# Altium schematic sheet IoTC.SchDoc
size A1
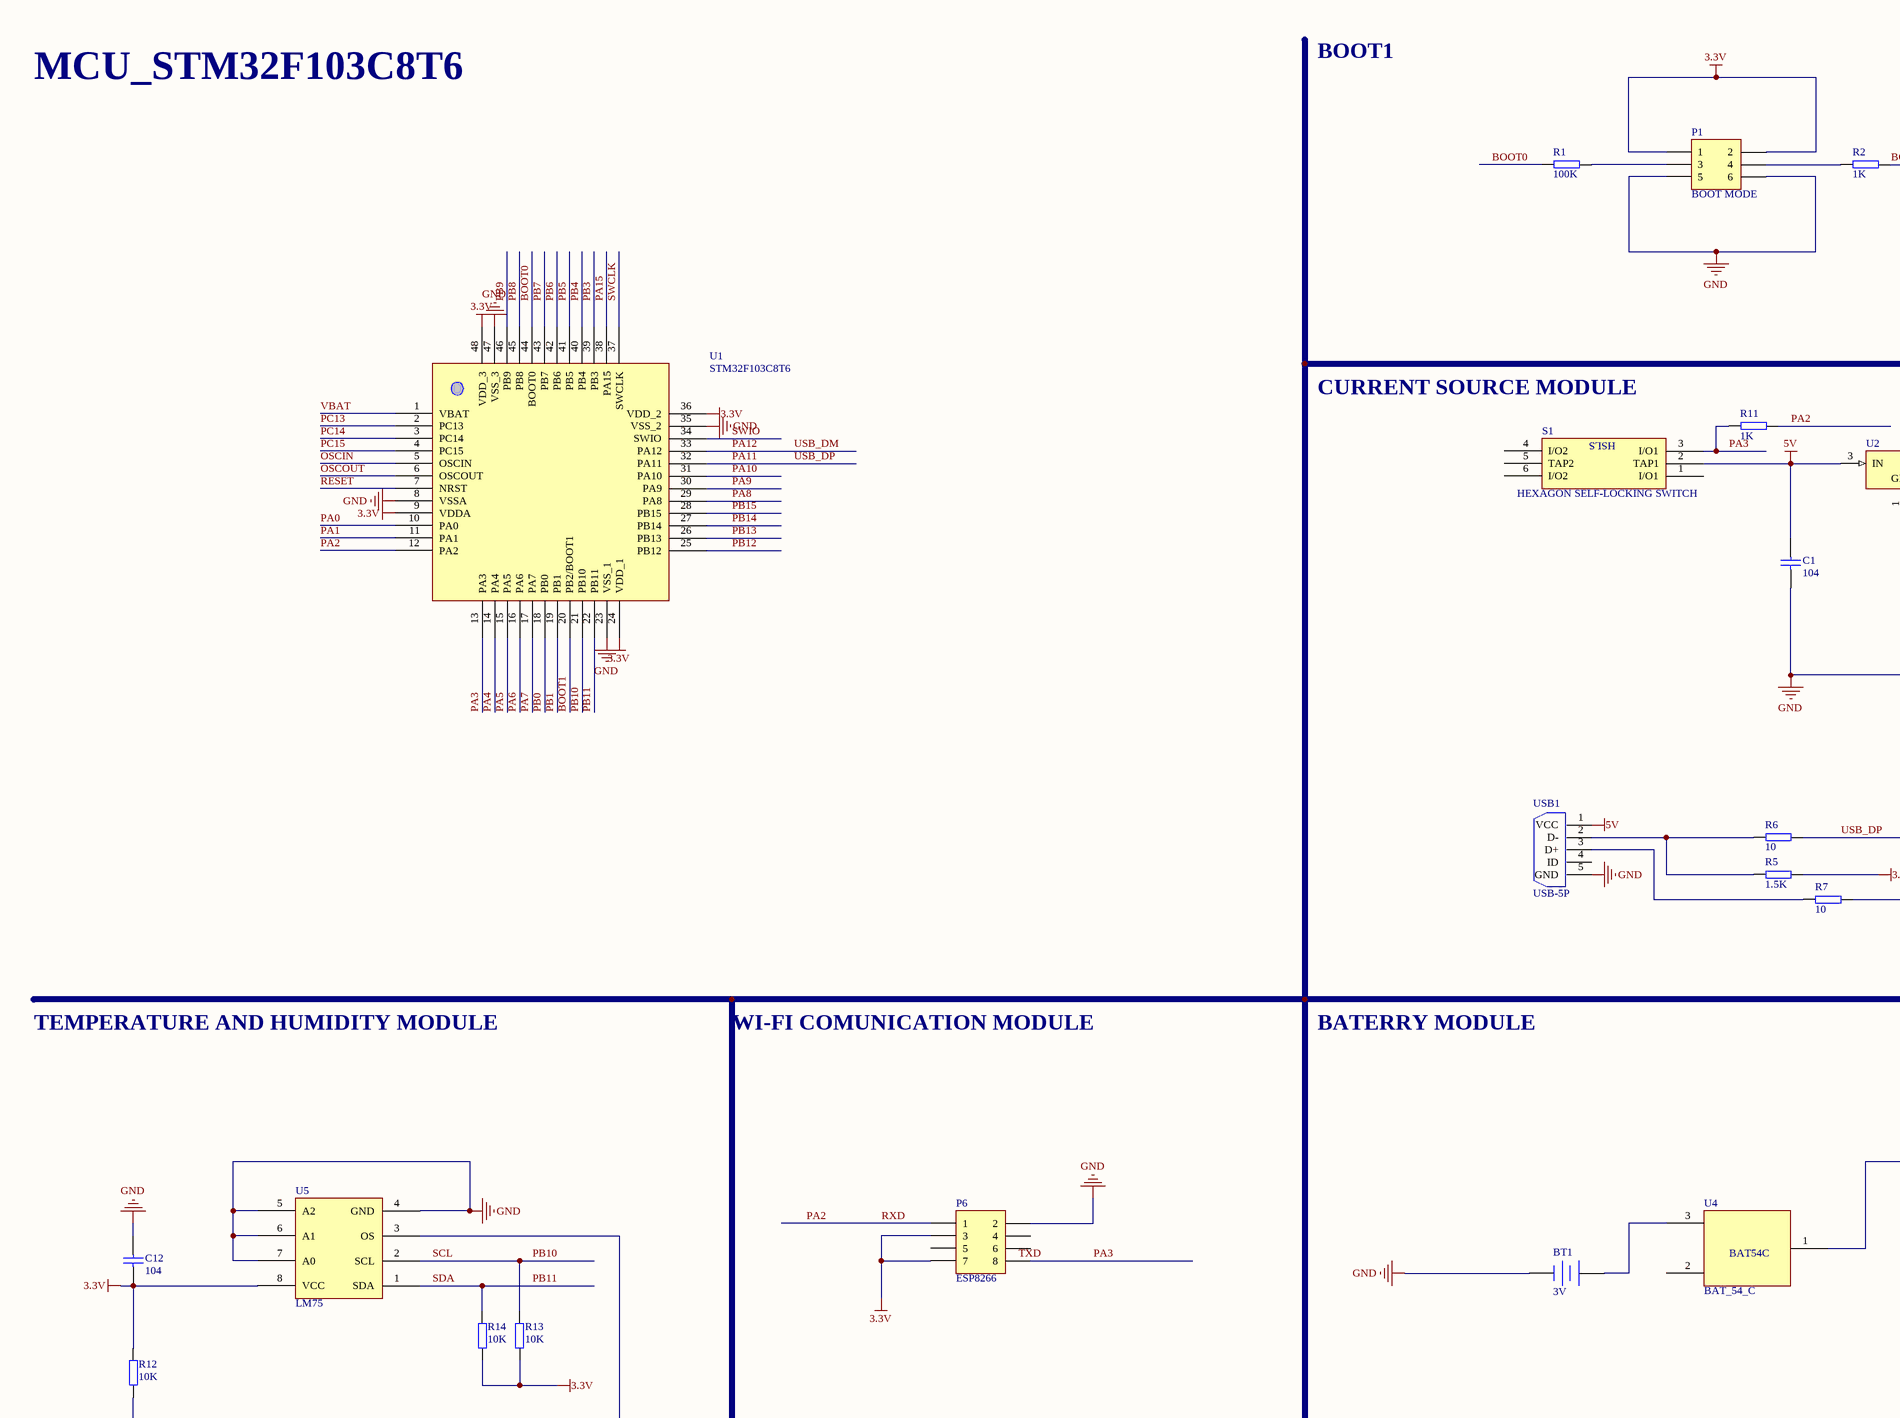
[diagram p0: IoTC.SchDoc, top left]
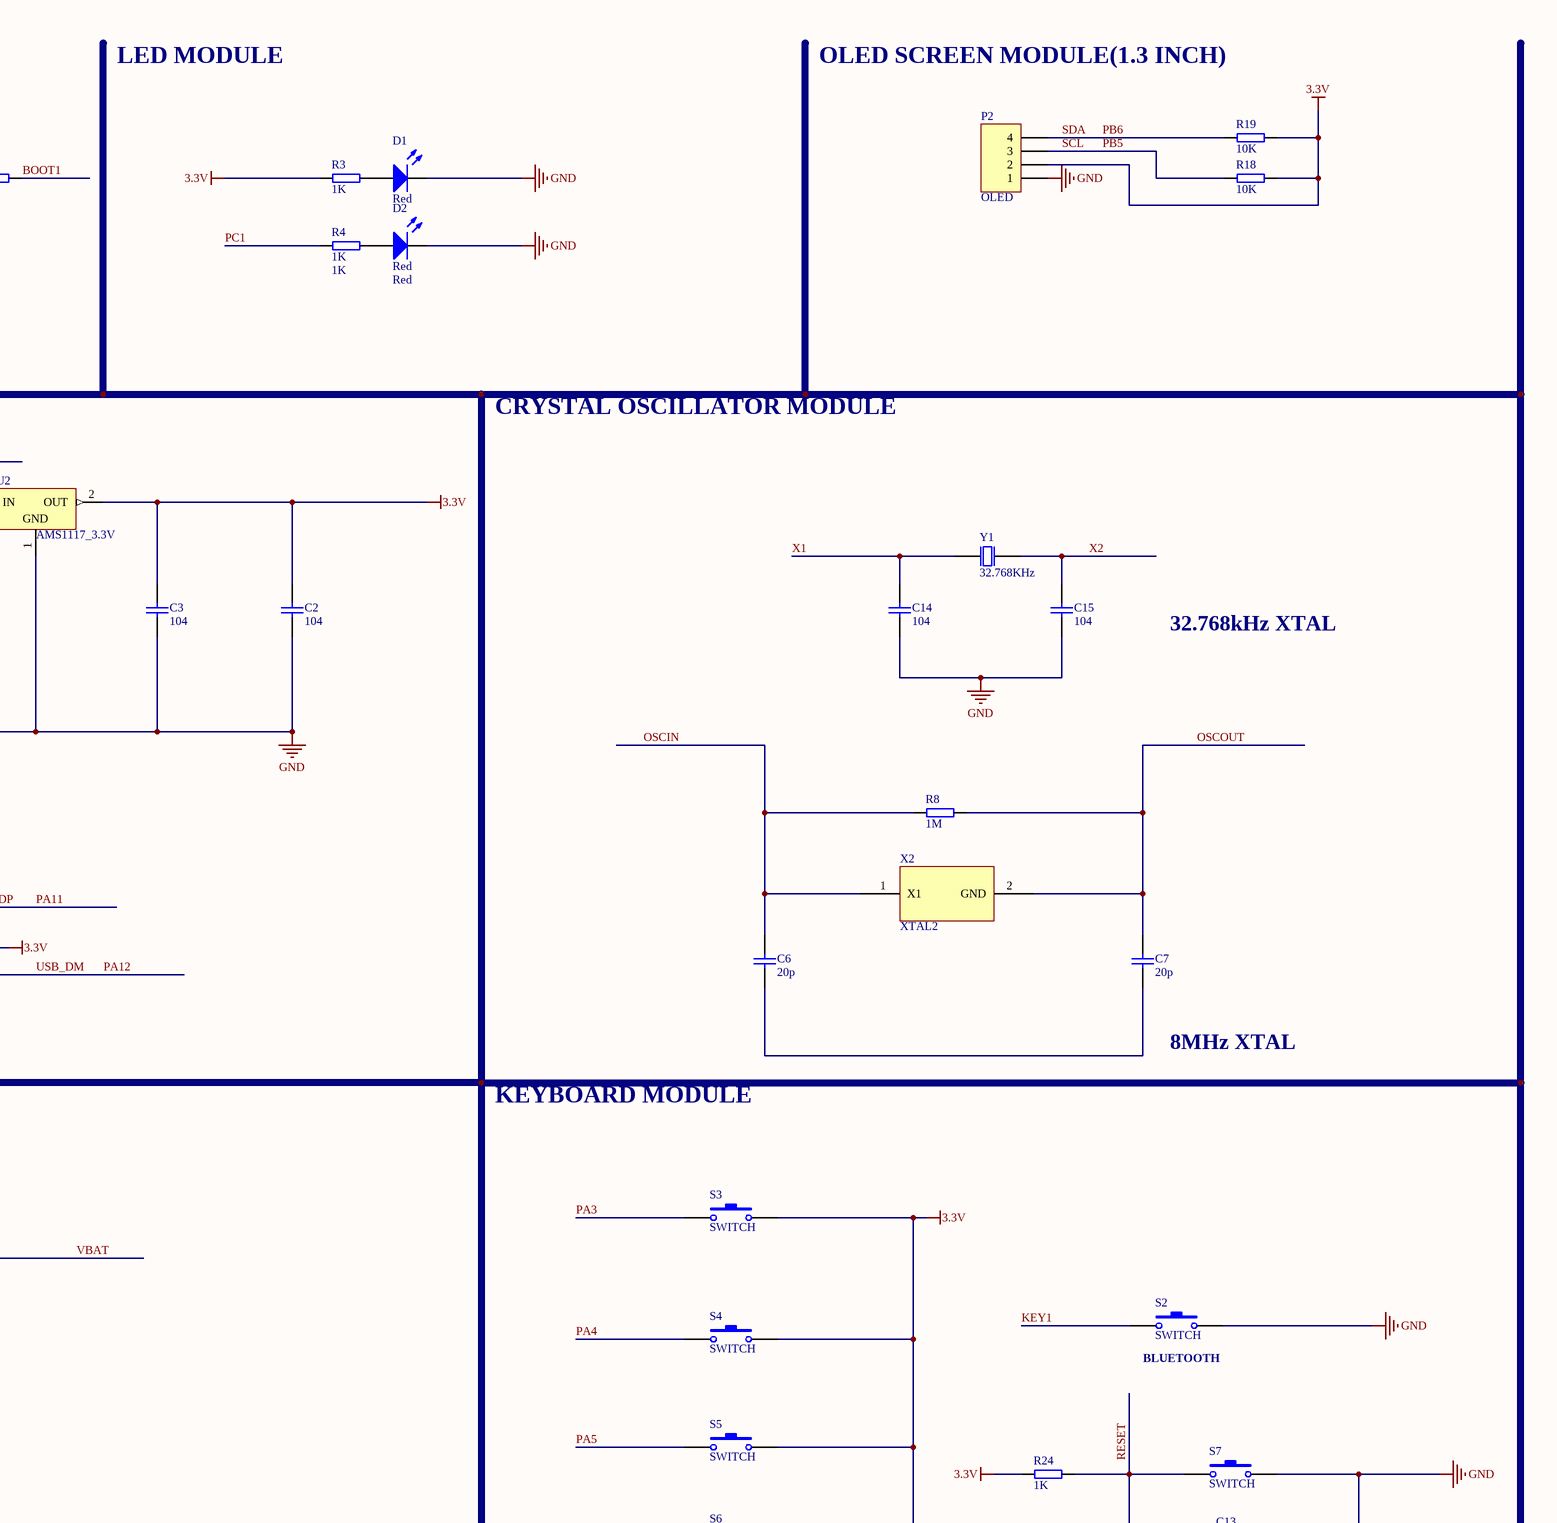
[diagram p1: IoTC.SchDoc, top right]
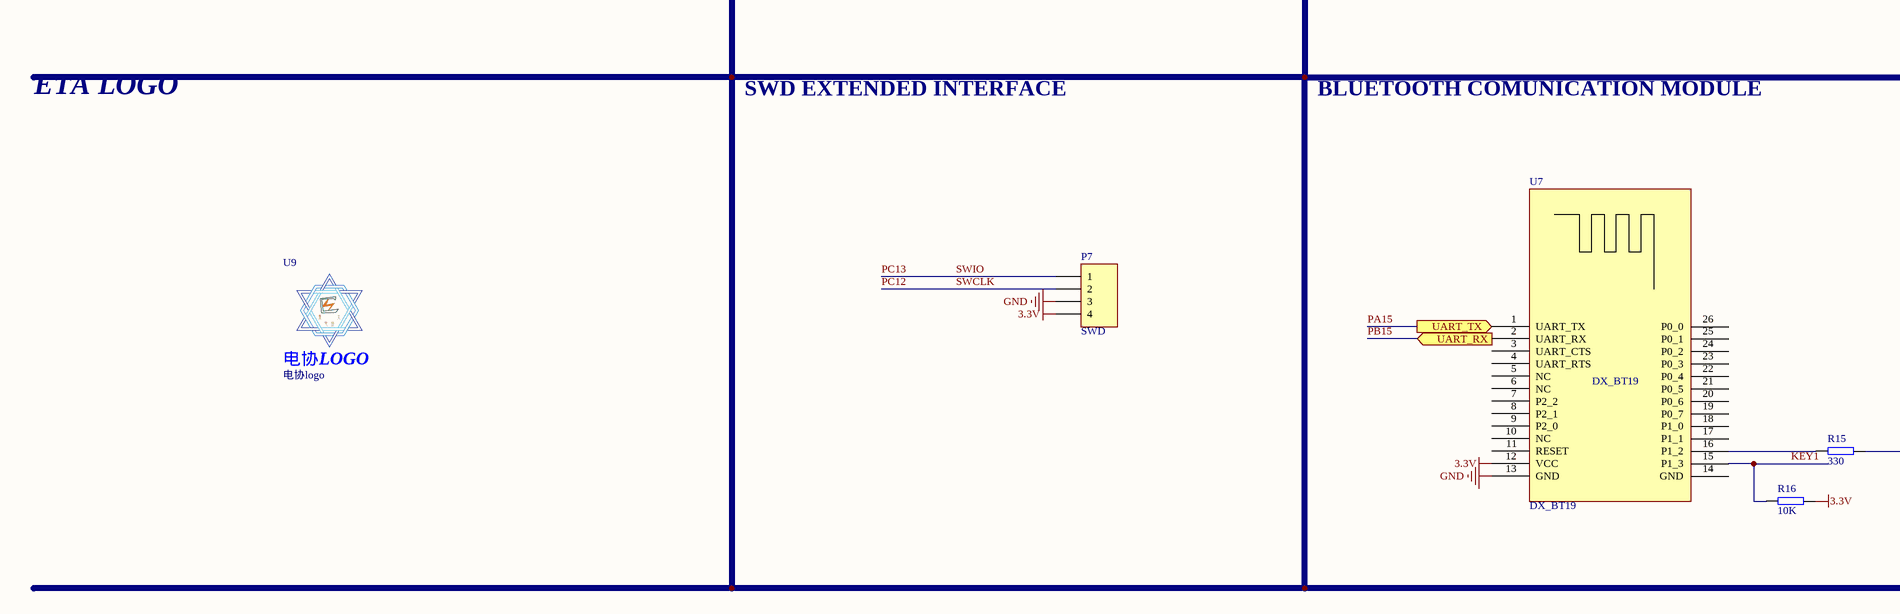
[diagram p2: IoTC.SchDoc, bottom left]
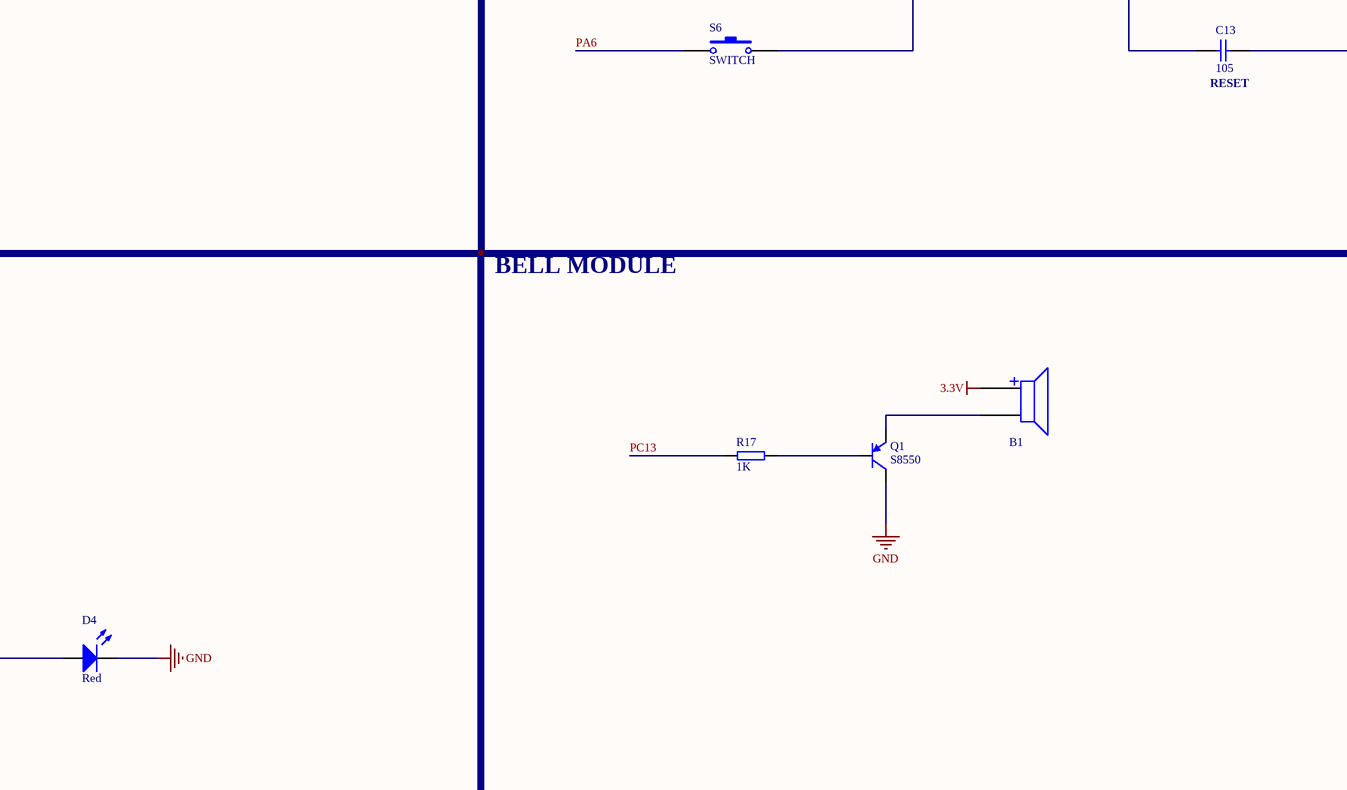
[diagram p3: IoTC.SchDoc, bottom right]

## Parts
B1  Buzzer  [BUZZER]  (value not drawn)
BT1  3V  [BAT-CR2032]
C1  104  [CAPC1608[0603]S]
C2  104  [CAPC1608[0603]S]
C3  104  [CAPC1608[0603]S]
C6  20p  [CAPC1608[0603]S]
C7  20p  [CAPC1608[0603]S]
C12  104  [CAPC1608[0603]S]
C13  105  [CAPC1608[0603]S]
C14  104  [CAPC1608[0603]S]
C15  104  [CAPC1608[0603]S]
D1  Red  [LEDC2012(0805)]
D2  Red  [LEDC2012(0805)]
D4  Red  [LEDC2012(0805)]
P1  BOOT MODE  [HDR2X3]
P2  OLED  [MHDR1X4]
P6  ESP8266  [MHDR2X4]
P7  SWD  [HDR1X4]
Q1  S8550  [TO-92B]
R1  100K  [RESC1608[0603]S]
R2  1K  [RESC1608[0603]S]
R3  1K  [RESC1608[0603]]
R4  1K  [RESC1608[0603]]
R5  1.5K  [RESC1608[0603]S]
R6  10  [RESC1608[0603]S]
R7  10  [RESC1608[0603]S]
R8  1M  [RESC1608[0603]S]
R11  1K  [RESC1608[0603]S]
R12  10K  [RESC1608[0603]S]
R13  10K  [RESC1608[0603]S]
R14  10K  [RESC1608[0603]S]
R15  330  [RESC1608[0603]S]
R16  10K  [RESC1608[0603]S]
R17  1K  [RESC1608[0603]]
R18  10K  [RESC1608[0603]S]
R19  10K  [RESC1608[0603]S]
R24  1K  [RESC1608[0603]S]
S1  HEXAGON SELF-LOCKING SWITCH  [六脚开关]
S2  SWITCH  [复位按键]
S3  SWITCH  [贴片复位开关]
S4  SWITCH  [贴片复位开关]
S5  SWITCH  [贴片复位开关]
S6  SWITCH  [贴片复位开关]
S7  SWITCH  [复位按键]
U1  STM32F103C8T6  [48P]
U2  AMS1117_3.3V  [SOT223]
U4  BAT_54_C  [SOT23]
U5  LM75  [SO-8M]
U7  DX_BT19  [DX_BT19]
U9  电协logo  [电协logo]
USB1  USB-5P  [MICRO_USB]
X2  XTAL2  [XTAL1]
Y1  32.768KHz  [XTAL-2]

## Ports
UART_RX (in), UART_TX (out)

## Nets
3.3V: B1.2 C2.2 C3.2 C12.1 P1.1 P1.2 P2.2 P6.3 P6.7 P7.4 R3.1 R5.2 R12.2 R13.1 R14.1 R16.2 R18.2 R19.2 R24.1 S3.2 S4.2 S5.2 S6.2 U1.9(VDDA) U1.24(VDD_1) U1.36(VDD_2) U1.48(VDD_3) U2.2(OUT) U5.8(VCC) U7.12(VCC)
5V: C1.2 S1.2(TAP1) U2.3(IN) USB1.1(VCC)
GND: BT1.1(-) C1.1 C2.1 C3.1 C12.2 C13.2 C14.1 C15.1 D1.C D2.C D4.C P1.5 P1.6 P2.1 P6.2 P7.3 Q1.3(C) S2.2 S7.2 U1.8(VSSA) U1.23(VSS_1) U1.35(VSS_2) U1.47(VSS_3) U2.1(GND) U5.4(GND) U5.5(A2) U5.6(A1) U5.7(A0) U7.13(GND) USB1.5(GND)
BOOT0: R1.1 U1.44(BOOT0)
BOOT1: R2.2 U1.20(PB2/BOOT1)
KEY1: R16.1 S2.1 U7.15(P1_3)
OSCIN: C6.2 R8.1 U1.5(OSCIN) X2.1(X1)
OSCOUT: C7.2 R8.2 U1.6(OSCOUT) X2.2(GND)
PA0: U1.10(PA0)
PA1: U1.11(PA1)
PA2: P6.1 R11.2 U1.12(PA2)  [also labelled RXD]
PA3: P6.8 R11.1 S1.3(I/O1) S3.1 U1.13(PA3)
PA4: S4.1 U1.14(PA4)
PA5: S5.1 U1.15(PA5)
PA6: S6.1 U1.16(PA6)
PA7: U1.17(PA7)
PA8: U1.29(PA8)
PA9: U1.30(PA9)
PA10: U1.31(PA10)
PA11: R6.2 U1.32(PA11)  [also labelled USB_DP]
PA12: R7.2 U1.33(PA12)  [also labelled USB_DM]
PA15: U1.38(PA15) U7.1(UART_TX) ; port UART_TX
PB0: U1.18(PB0)
PB1: U1.19(PB1)
PB3: U1.39(PB3)
PB4: U1.40(PB4)
PB7: U1.43(PB7)
PB8: U1.45(PB8)
PB9: U1.46(PB9)
PB10: P2.3 R13.2 R18.1 U1.21(PB10) U1.41(PB5) U5.2(SCL)  [also labelled PB5, SCL]
PB11: P2.4 R14.2 R19.1 U1.22(PB11) U1.42(PB6) U5.1(SDA)  [also labelled PB6, SDA]
PB12: U1.25(PB12)
PB13: U1.26(PB13)
PB14: U1.27(PB14)
PB15: U1.28(PB15) U7.2(UART_RX) ; port UART_RX
PC1: R4.1
PC12: P7.2 U1.37(SWCLK)  [also labelled SWCLK]
PC13: P7.1 R17.1 U1.2(PC13) U1.34(SWIO)  [also labelled SWIO]
PC14: U1.3(PC14)
PC15: U1.4(PC15)
RESET: C13.1 R24.2 S7.1 U1.7(NRST)
VBAT: U1.1(VBAT) U4.1
X1: C14.2 Y1.1(OSC1)
X2: C15.2 Y1.2(OSC2)
NetB1_1: B1.1 Q1.1(E)
NetBT1_2: BT1.2(+) U4.3
NetC6_1: C6.1 C7.1
NetD1_A: D1.A R3.2
NetD2_A: D2.A R4.2
NetD4_A: D4.A R15.2
NetP1_3: P1.3 R1.2
NetP1_4: P1.4 R2.1
NetQ1_2: Q1.2(B) R17.2
NetR5_1: R5.1 R6.1 USB1.2(D-)
NetR7_1: R7.1 USB1.3(D+)
NetR12_1: R12.1 U5.3(OS)
NetR15_1: R15.1 U7.16(P1_2)

Not connected (* = marked no-connect by the designer): P6 4 5 6; S1 1(I/O1) 4(I/O2) 5(TAP2) 6(I/O2); U4 2; U7 3(UART_CTS) 4(UART_RTS) 5(NC) 6(NC) 7(P2_2) 8(P2_1) 9(P2_0) 10(NC) 11(RESET) 14(GND) 17(P1_1) 18(P1_0) 19(P0_7) 20(P0_6) 21(P0_5) 22(P0_4) 23(P0_3) 24(P0_2) 25(P0_1) 26(P0_0); USB1 4(ID)

## Notes on the sheet
- BOOT1
- LED MODULE
- OLED SCREEN MODULE(1.3 INCH)
- MCU_STM32F103C8T6
- CURRENT SOURCE MODULE
- CRYSTAL OSCILLATOR MODULE
- 32.768kHz XTAL
- 8MHz XTAL
- TEMPERATURE AND HUMIDITY MODULE
- WI-FI COMUNICATION MODULE
- BATERRY MODULE
- KEYBOARD MODULE
- (near S2) BLUETOOTH
- (near C13) RESET
- ETA LOGO
- SWD EXTENDED INTERFACE
- BLUETOOTH COMUNICATION MODULE
- BELL MODULE
- Labels drawn without touching a wire or pin: TXD
- (in symbol Component_1) HSLS; BAT54C
- (in symbol 电协logo) 电协LOGO

## Library data of the parts
B1 = Buzzer: PartNumber: P/N; Voltage: 5V; Price(RMB): 0.000
BT1 = Battery Negtive: Multicell Battery; PartNumber: P/N; Published: 24-Mar-1999; Revision: July-2002: Re-released for DXP Platform.; Publisher: Altium Limited; Voltage: 3V; Price(RMB): 0.000
C1-C3 C6 C7 C12-C15 = Cap Chip 2: Chip Capacitor, Silkscreen Border; Voltage: 63V; Tolerance: Y5V; Published: 8-Jun-2000; Revision: July-2002: Re-released for DXP Platform.; Publisher: Altium Limited; Price(RMB): 0.000
  C1-C3 C12 C14 C15: Value: 104
  C6 C7: Value: 20p
  C13: Value: 105
D1 D2 D4 = LED Chip: Typical Chip LED; Published: 8-Jun-2000; Revision: July-2002: Re-released for DXP Platform.; Publisher: Altium Limited; Price(RMB): 0.00; Color: Red
P1 = Header 3X2: Header, 3-Pin, Dual row; LatestRevisionDate: 17-Jul-2002; LatestRevisionNote: Re-released for DXP Platform.; Publisher: Altium Limited; Price(RMB): 0.00
P2 = MHDR1X4: Header, 4-Pin; LatestRevisionDate: 17-Jul-2002; LatestRevisionNote: Re-released for DXP Platform.; Publisher: Altium Limited
P6 = MHDR2X4: Header, 4-Pin, Dual row; LatestRevisionDate: 17-Jul-2002; LatestRevisionNote: Re-released for DXP Platform.; Publisher: Altium Limited
P7 = Header 4: Header, 4-Pin; LatestRevisionDate: 17-Jul-2002; LatestRevisionNote: Re-released for DXP Platform.; Publisher: Altium Limited
Q1 = PNP S8550: Discrete PNP Bipolar Transistor; Published: 8-Jun-2000; Revision: July-2002: Re-released for DXP Platform.; Publisher: Altium Limited; Price(RMB): 0.000; PartNumber: S8550
R1 R2 R5 R6 R8 R11-R15 R18 R19 R24 = Res Chip 2p 2: Chip Resistor, Border Silkscreen On PCB Library; Tolerance: 5%; Published: 8-Jun-2000; Revision: July-2002: Re-released for DXP Platform.; Publisher: Altium Limited; Price(RMB): 0.000
  R1: Value: 100K
  R2 R11 R24: Value: 1K
  R5: Value: 1.5K
  R6: Value: 10
  R8: Value: 1M
  R12-R14 R18 R19: Value: 10K
  R15: Value: 330
R3 R4 R17 = Res Chip 2p 1: Chip Resistor, PSpice Model, IPC PCB Library Drawing; Tolerance: 5%; TC1: 0; Published: 8-Jun-2000; Revision: July-2002: Re-released for DXP Platform.; Publisher: Altium Limited; Price(RMB): 0.000; TC2: 0; Value: 1K
R7 R16 = Res Chip 2p 2: Chip Resistor, Border Silkscreen On PCB Library; Tolerance: 5%; Value: 1K; Published: 8-Jun-2000; Revision: July-2002: Re-released for DXP Platform.; Publisher: Altium Limited; Price(RMB): 0.000
S1 U4 U5 U7 X2 = Component_1
S2-S7 = 轻触开关
U2 = AMS1117: POSITIVE OUTPUT VOLTAGE; Price(RMB): 0.000; PartNumber: AMS1117_3.3V
USB1 = USB-5P: 微型USB母座; 版权归属: 源创客; BOM名称: 微型USB母座; 学习资源: www.ooocke.com
Y1 = XTAL: Crystal Oscillator; Value: 12MHz; Published: 8-Jun-2000; Revision: July-2002: Re-released for DXP Platform.; Publisher: Altium Limited; Price(RMB): 0.000